# Altium schematic sheet v2.0.SchDoc
size 116 x 50 mm
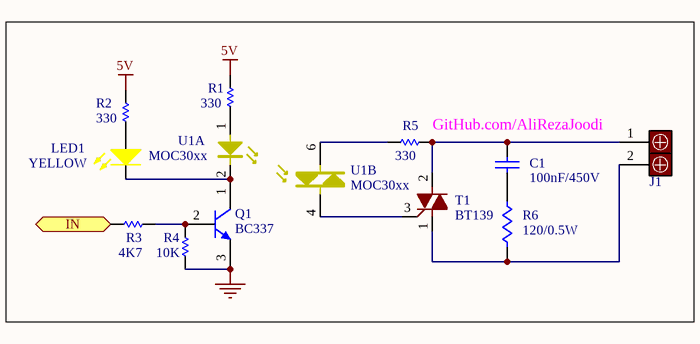
[diagram p0: v2.0.SchDoc]

## Parts
C1  100nF/450V  [CAPR7.62-6.8x5]
J1  2PIN  [Connector_Phoenix_2PIN_MSTB]  (value not drawn)
LED1  YELLOW  [LED_THD_3MM_YELLOW_R]
Q1  BC337  [TO92_3Pin_Form3]
R1  330  [R_THD_AXIAL0.4(1/4W)]
R2  330  [R_THD_AXIAL0.4(1/4W)]
R3  4K7  [R_THD_AXIAL0.4(1/4W)]
R4  10K  [R_THD_AXIAL0.4(1/4W)]
R5  330  [R_THD_AXIAL0.4(1/4W)]
R6  120/0.5W  [AXIAL-0.4]
T1  BT139  [TO220_3PIN_V]
U1  MOC30xx  [DIP_6]  (parts A,B of 2)

## Ports
IN (in)

## Nets
5V: R1.2 R2.2
GND: Q1.3(E) R4.2
IN: R3.2 ; port IN
NetC1_1: C1.1 R6.2
NetC1_2: C1.2 J1.1 R5.2 T1.2(T2)
NetJ1_2: J1.2 R6.1 T1.1(T1)
NetLED1_1: LED1.1(A) R2.1
NetLED1_2: LED1.2(K) Q1.1(C) U1.2(K)
NetQ1_2: Q1.2(B) R3.1 R4.1
NetR1_1: R1.1 U1.1(A)
NetR5_1: R5.1 U1.6(A/K)
NetT1_3: T1.3(G) U1.4(A/K)

## Notes on the sheet
- GitHub.com/AliRezaJoodi

## Library data of the parts
C1 = Cap: Capacitor; Manufacturer: Generic Components; Class I: Passive; Published: 8-Jun-2000; Revision: July-2002: Re-released for DXP Platform.; Publisher: Altium Limited; Class II: Capacitor
J1 = Connector1x2_Power2: Connector, Header, 2Pin; Revision: July-2002: Re-released for DXP Platform.
LED1 = LED_YELLOW: LED, Yellow; Manufacturer: Generic Components; Class I: Optoelectronic; Published: 8-Jun-2000; Revision: July-2002: Re-released for DXP Platform.; Publisher: Altium Limited; Class II: LED
Q1 = Transistor_BJT_NPN: Transistor, BJT, NPN; Package Reference: TO-92A
R1-R5 = Resistor: Revision: July-2002: Re-released for DXP Platform.
R6 = Res1: Resistor; Manufacturer: Generic Components; Class I: Passive; Published: 8-Jun-2000; Revision: July-2002: Re-released for DXP Platform.; Publisher: Altium Limited; Class II: Resistor
T1 = Triac: Triac,
U1 = MOC3021: Opto-Triac